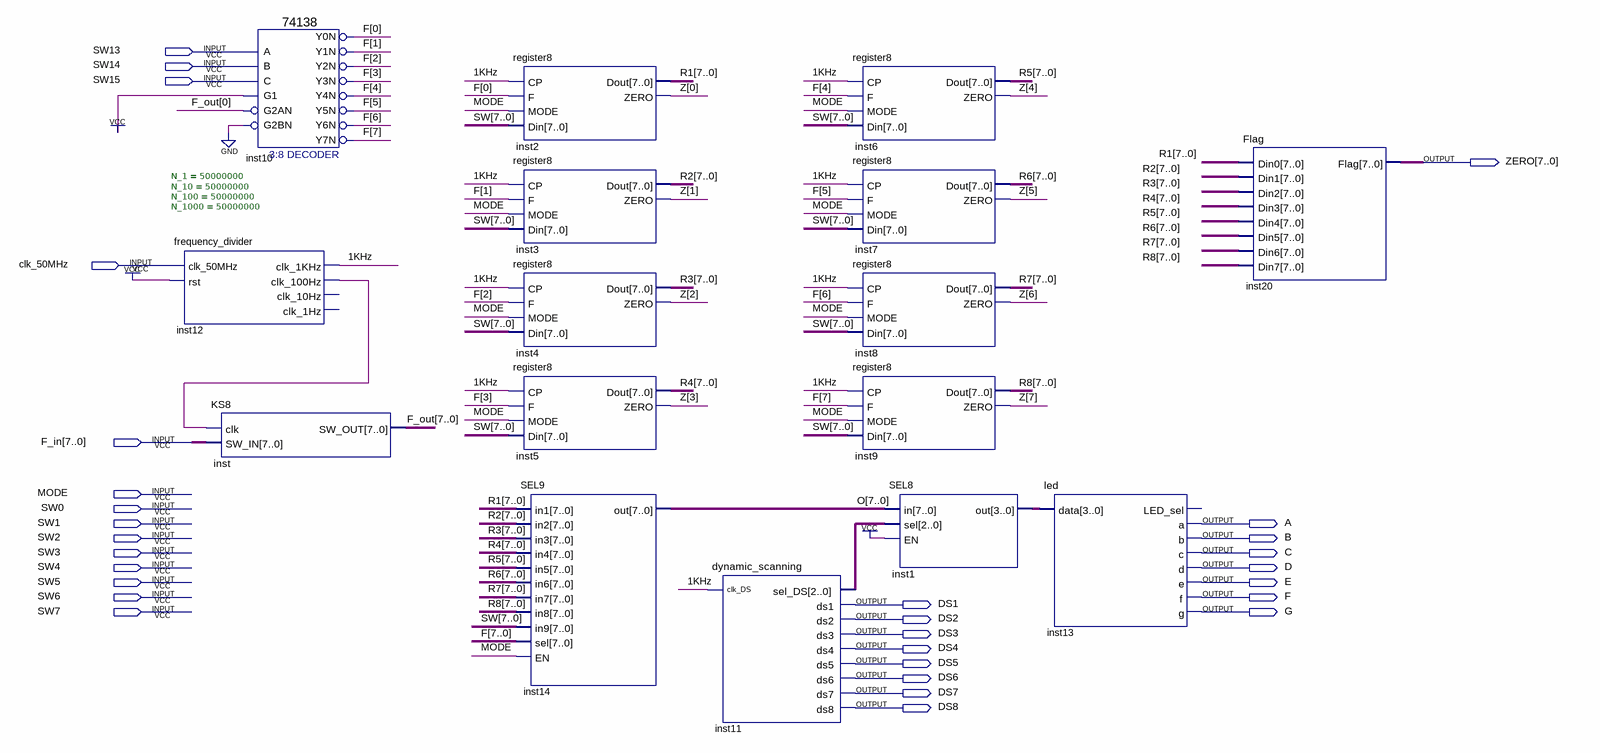
[diagram p0: schematic sheet]
// Quartus schematic project9.bdf as structural Verilog: 16 symbols, 30 pins
module project9 (
  input  SW13,
  input  SW14,
  input  SW15,
  input  clk_50MHz,
  input  [7:0] F_in,
  input  MODE,
  input  SW0,
  input  SW1,
  input  SW2,
  input  SW3,
  input  SW4,
  input  SW5,
  input  SW6,
  input  SW7,
  output [7:0] ZERO,
  output A,
  output B,
  output C,
  output D,
  output E,
  output F,
  output DS1,
  output G,
  output DS2,
  output DS3,
  output DS4,
  output DS5,
  output DS6,
  output DS7,
  output DS8
);

  wire \1KHz , inst12_clk_100hz;
  wire [2:0] inst11_sel_ds;
  wire [3:0] inst1_out;
  wire [7:0] F_bus, F_out, O, R1, R2, R3, R4, R5, R6, R7, R8, Z;

  frequency_divider #(.N_1(50000000), .N_10(50000000), .N_100(50000000), .N_1000(50000000)) inst12 (
    .clk_50MHz(clk_50MHz), .rst(1'b1), .clk_1KHz(\1KHz ), .clk_100Hz(inst12_clk_100hz));  // open: clk_10Hz, clk_1Hz
  KS8 inst (.clk(inst12_clk_100hz), .SW_IN(F_in), .SW_OUT(F_out));
  \74138  inst10 (
    .A(SW13), .B(SW14), .G1(1'b1), .C(SW15), .G2AN(F_out[0]), .G2BN(1'b0), .Y0N(F_bus[0]), .Y1N(F_bus[1]),
    .Y2N(F_bus[2]), .Y3N(F_bus[3]), .Y4N(F_bus[4]), .Y5N(F_bus[5]), .Y6N(F_bus[6]), .Y7N(F_bus[7]));
  register8 inst2 (
    .CP(\1KHz ), .F(F_bus[0]), .MODE(MODE), .Din({SW7, SW6, SW5, SW4, SW3, SW2, SW1, SW0}), .Dout(R1),
    .ZERO(Z[0]));
  register8 inst3 (
    .CP(\1KHz ), .F(F_bus[1]), .MODE(MODE), .Din({SW7, SW6, SW5, SW4, SW3, SW2, SW1, SW0}), .Dout(R2),
    .ZERO(Z[1]));
  register8 inst4 (
    .CP(\1KHz ), .F(F_bus[2]), .MODE(MODE), .Din({SW7, SW6, SW5, SW4, SW3, SW2, SW1, SW0}), .Dout(R3),
    .ZERO(Z[2]));
  register8 inst5 (
    .CP(\1KHz ), .F(F_bus[3]), .MODE(MODE), .Din({SW7, SW6, SW5, SW4, SW3, SW2, SW1, SW0}), .Dout(R4),
    .ZERO(Z[3]));
  SEL9 inst14 (
    .in1(R1), .in2(R2), .in3(R3), .in4(R4), .in5(R5), .in6(R6), .in7(R7), .in8(R8),
    .in9({SW7, SW6, SW5, SW4, SW3, SW2, SW1, SW0}), .sel(F_bus), .EN(MODE), .out(O));
  dynamic_scanning inst11 (
    .clk_DS(\1KHz ), .sel_DS(inst11_sel_ds), .ds1(DS1), .ds2(DS2), .ds3(DS3), .ds4(DS4), .ds5(DS5),
    .ds6(DS6), .ds7(DS7), .ds8(DS8));
  register8 inst6 (
    .CP(\1KHz ), .F(F_bus[4]), .MODE(MODE), .Din({SW7, SW6, SW5, SW4, SW3, SW2, SW1, SW0}), .Dout(R5),
    .ZERO(Z[4]));
  register8 inst7 (
    .CP(\1KHz ), .F(F_bus[5]), .MODE(MODE), .Din({SW7, SW6, SW5, SW4, SW3, SW2, SW1, SW0}), .Dout(R6),
    .ZERO(Z[5]));
  register8 inst8 (
    .CP(\1KHz ), .F(F_bus[6]), .MODE(MODE), .Din({SW7, SW6, SW5, SW4, SW3, SW2, SW1, SW0}), .Dout(R7),
    .ZERO(Z[6]));
  register8 inst9 (
    .CP(\1KHz ), .F(F_bus[7]), .MODE(MODE), .Din({SW7, SW6, SW5, SW4, SW3, SW2, SW1, SW0}), .Dout(R8),
    .ZERO(Z[7]));
  SEL8 inst1 (.in(O), .sel(inst11_sel_ds), .EN(1'b1), .out(inst1_out));
  led inst13 (.data(inst1_out), .a(A), .b(B), .c(C), .d(D), .e(E), .f(F), .g(G));  // open: LED_sel
  Flag inst20 (.Din0(R1), .Din1(R2), .Din2(R3), .Din3(R4), .Din4(R5), .Din5(R6), .Din6(R7), .Din7(R8), .Flag(ZERO));
endmodule
